# Altium schematic sheet Main_Connector.SchDoc
size A4; SheetNumber: 12; SheetTotal: 16
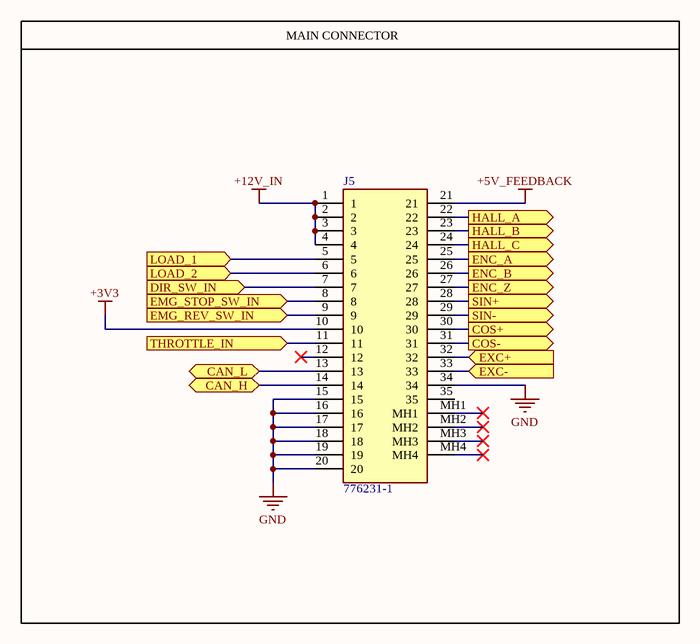
[diagram p0: Main_Connector.SchDoc]

## Parts
J5  776231-1  [7762311]

## Blocks framed on the sheet
MAIN CONNECTOR: J5

## Ports
CAN_H (bidir, see Interconnections[2B], Communications[2A]), CAN_L (bidir, see Interconnections[2B], Communications[2A]), COS+ (out, see Interconnections[2B], Feedback_Sensors[1C]), COS- (out, see Interconnections[2B], Feedback_Sensors[1D]), DIR_SW_IN (in, see Interconnections[2A], IO_Expander[2B]), EMG_REV_SW_IN (in, see Interconnections[2A], IO_Expander[1D]), EMG_STOP_SW_IN (in, see Interconnections[2A], IO_Expander[1C]), ENC_A (out, see Interconnections[2B], Feedback_Sensors[5B]), ENC_B (out, see Interconnections[2B], Feedback_Sensors[5B]), ENC_Z (out, see Interconnections[2B], Feedback_Sensors[5B]), EXC+ (in, see Interconnections[2B], Feedback_Sensors[2A]), EXC- (in, see Interconnections[2B], Feedback_Sensors[3A]), HALL_A (out, see Interconnections[2B], Feedback_Sensors[5A]), HALL_B (out, see Interconnections[2B], Feedback_Sensors[5A]), HALL_C (out, see Interconnections[2B], Feedback_Sensors[5A]), LOAD_1 (in, see Interconnections[2A], Load_Switches[5A]), LOAD_2 (in, see Interconnections[2A], Load_Switches[5B]), SIN+ (out, see Interconnections[2B], Feedback_Sensors[1C]), SIN- (out, see Interconnections[2B], Feedback_Sensors[1C]), THROTTLE_IN (in, see Interconnections[2B], AD_Converter[2C])

## Nets
+3V3: J5.10
+5V_FEEDBACK: J5.21
+12V_IN: J5.1 J5.2 J5.3 J5.4
GND: J5.15 J5.16 J5.17 J5.18 J5.19 J5.20 J5.34
CAN_H: J5.14 ; port CAN_H
CAN_L: J5.13 ; port CAN_L
COS+: J5.30 ; port COS+
COS-: J5.31 ; port COS-
DIR_SW_IN: J5.7 ; port DIR_SW_IN
EMG_REV_SW_IN: J5.9 ; port EMG_REV_SW_IN
EMG_STOP_SW_IN: J5.8 ; port EMG_STOP_SW_IN
ENC_A: J5.25 ; port ENC_A
ENC_B: J5.26 ; port ENC_B
ENC_Z: J5.27 ; port ENC_Z
EXC+: J5.32 ; port EXC+
EXC-: J5.33 ; port EXC-
HALL_A: J5.22 ; port HALL_A
HALL_B: J5.23 ; port HALL_B
HALL_C: J5.24 ; port HALL_C
LOAD_1: J5.5 ; port LOAD_1
LOAD_2: J5.6 ; port LOAD_2
SIN+: J5.28 ; port SIN+
SIN-: J5.29 ; port SIN-
THROTTLE_IN: J5.11 ; port THROTTLE_IN

Not connected (* = marked no-connect by the designer): J5 12* 35 MH1* MH2* MH3* MH4*

## Library data of the parts
J5 = 776231-1: Connector; Manufacturer_Name: TE Connectivity; Datasheet Link: https://www.te.com/commerce/DocumentDelivery/DDEController?Action=srchrtrv&DocNm=1-1773979-2&DocType=Data%20Sheet&DocLang=English&PartCntxt=776231-1&DocFormat=pdf; Height: 34.25mm; Manufacturer_Part_Number: 776231-1; Mouser Part Number: 571-776231-1; Mouser Price/Stock: https://www.mouser.co.uk/ProductDetail/TE-Connectivity/776231-1?qs=YqNA2qefETAQAJm2ankyIA%3D%3D; Arrow Part Number: 776231-1; Arrow Price/Stock: https://www.arrow.com/en/products/776231-1/te-connectivity?region=nac